# Altium project GeneratedSystem.PrjPcb
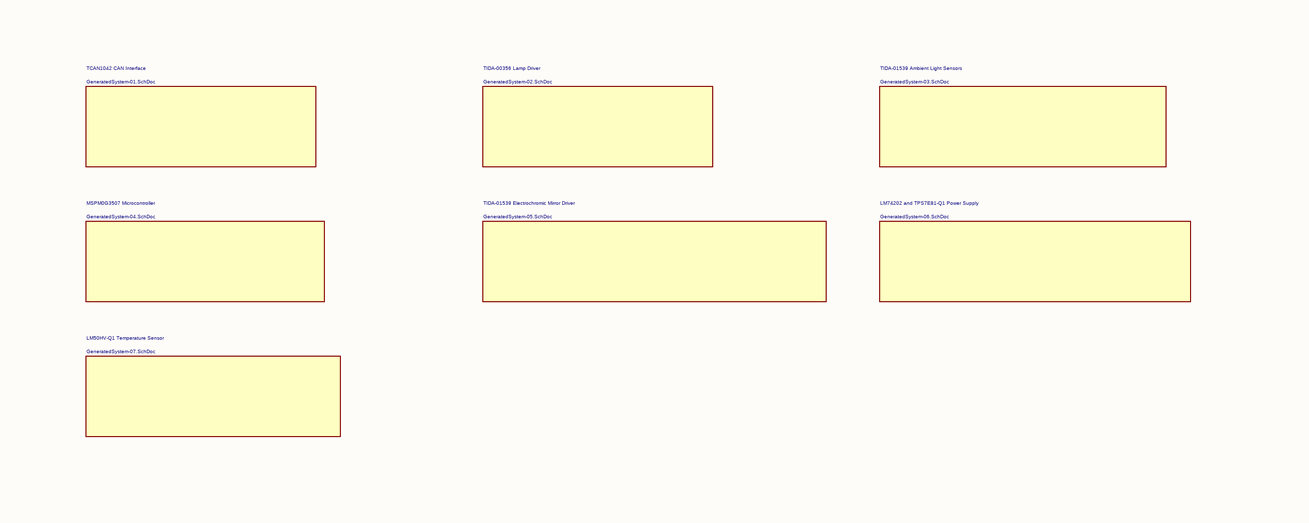
[diagram p0: GeneratedSystem.SchDoc]
8 sheets, 73 parts. Net scope: global (net labels, ports and power ports of the same name join across sheets).
Board file: GeneratedSystem.PcbDoc
Sheets:
  GeneratedSystem.SchDoc
    TCAN1042 CAN Interface = GeneratedSystem-01.SchDoc
    TIDA-00356 Lamp Driver = GeneratedSystem-02.SchDoc
    TIDA-01539 Ambient Light Sensors = GeneratedSystem-03.SchDoc
    MSPM0G3507 Microcontroller = GeneratedSystem-04.SchDoc
    TIDA-01539 Electrochromic Mirror Driver = GeneratedSystem-05.SchDoc
    LM74202 and TPS7E81-Q1 Power Supply = GeneratedSystem-06.SchDoc
    LM50HV-Q1 Temperature Sensor = GeneratedSystem-07.SchDoc

## Sheet GeneratedSystem.SchDoc
size 244 x 96 mm

### Sub-sheets
LM50HV-Q1 Temperature Sensor = GeneratedSystem-07.SchDoc: no entries
LM74202 and TPS7E81-Q1 Power Supply = GeneratedSystem-06.SchDoc: no entries
MSPM0G3507 Microcontroller = GeneratedSystem-04.SchDoc: no entries
TCAN1042 CAN Interface = GeneratedSystem-01.SchDoc: no entries
TIDA-00356 Lamp Driver = GeneratedSystem-02.SchDoc: no entries
TIDA-01539 Ambient Light Sensors = GeneratedSystem-03.SchDoc: no entries
TIDA-01539 Electrochromic Mirror Driver = GeneratedSystem-05.SchDoc: no entries

## Sheet GeneratedSystem-01.SchDoc
size 141 x 76 mm
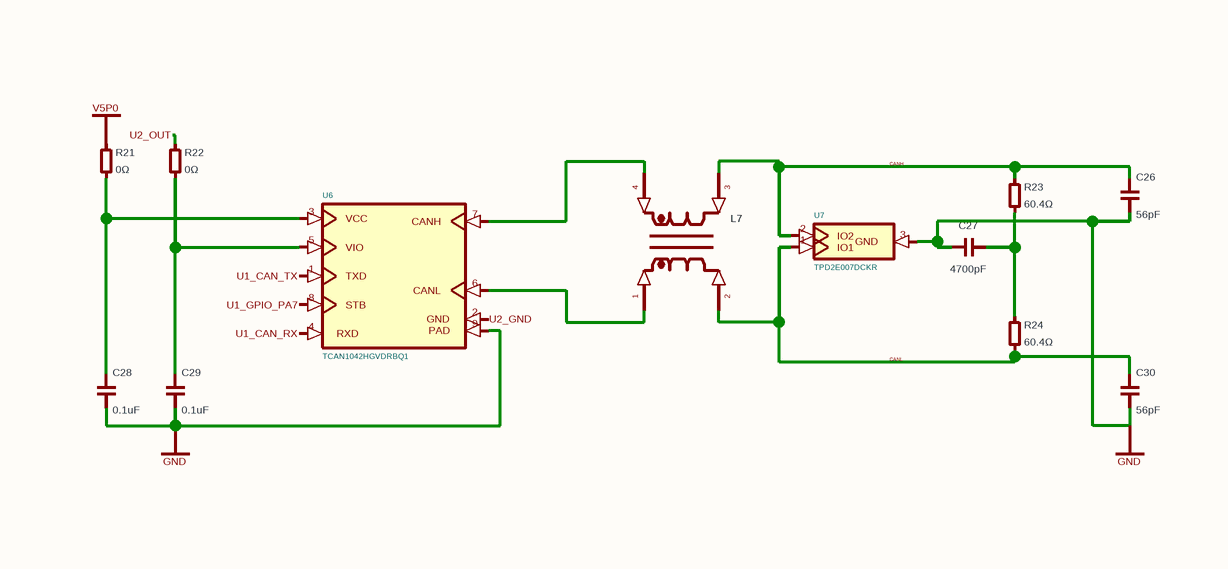
[diagram p1: GeneratedSystem-01.SchDoc]

### Parts
C26  56pF
C27  4700pF
C28  0.1uF
C29  0.1uF
C30  56pF
L7  (no value)
R21  0Ω
R22  0Ω
R23  60.4Ω
R24  60.4Ω
U6  (no value)
U7  (no value)

### Nets
GND: C26.2(cathode) C27.1(pos) C28.2(cathode) C29.2(cathode) C30.2(cathode) U6.9(PAD) U7.3(GND)
V5P0: R21.1(anode)
U1_CAN_RX: U6.4(RXD)
U1_CAN_TX: U6.1(TXD)
U1_GPIO_PA7: U6.8(STB)
U2_GND: U6.2(GND)
U2_OUT: R22.1(anode)
NetC26_1: C26.1(anode) L7.3(pin3) R23.1(anode) U7.2(IO2)
NetC27_2: C27.2(neg) R23.2(cathode) R24.1(anode)
NetC28_1: C28.1(anode) R21.2(cathode) U6.3(VCC)
NetC29_1: C29.1(anode) R22.2(cathode) U6.5(VIO)
NetC30_1: C30.1(anode) L7.2(pin2) R24.2(cathode) U7.1(IO1)
NetL7_1: L7.1(pin1) U6.6(CANL)
NetL7_4: L7.4(pin4) U6.7(CANH)

### Notes on the sheet
- CANH
- CANL
- (in symbol U6) TCAN1042HGVDRBQ1
- (in symbol U7) TPD2E007DCKR

### Library data of the parts
C26 C28-C30 = capacitor_down
C27 = capacitor_right
L7 = L7
R21-R24 = boxresistor_down
U6 = U6
U7 = U7

## Sheet GeneratedSystem-02.SchDoc
size 168 x 103 mm
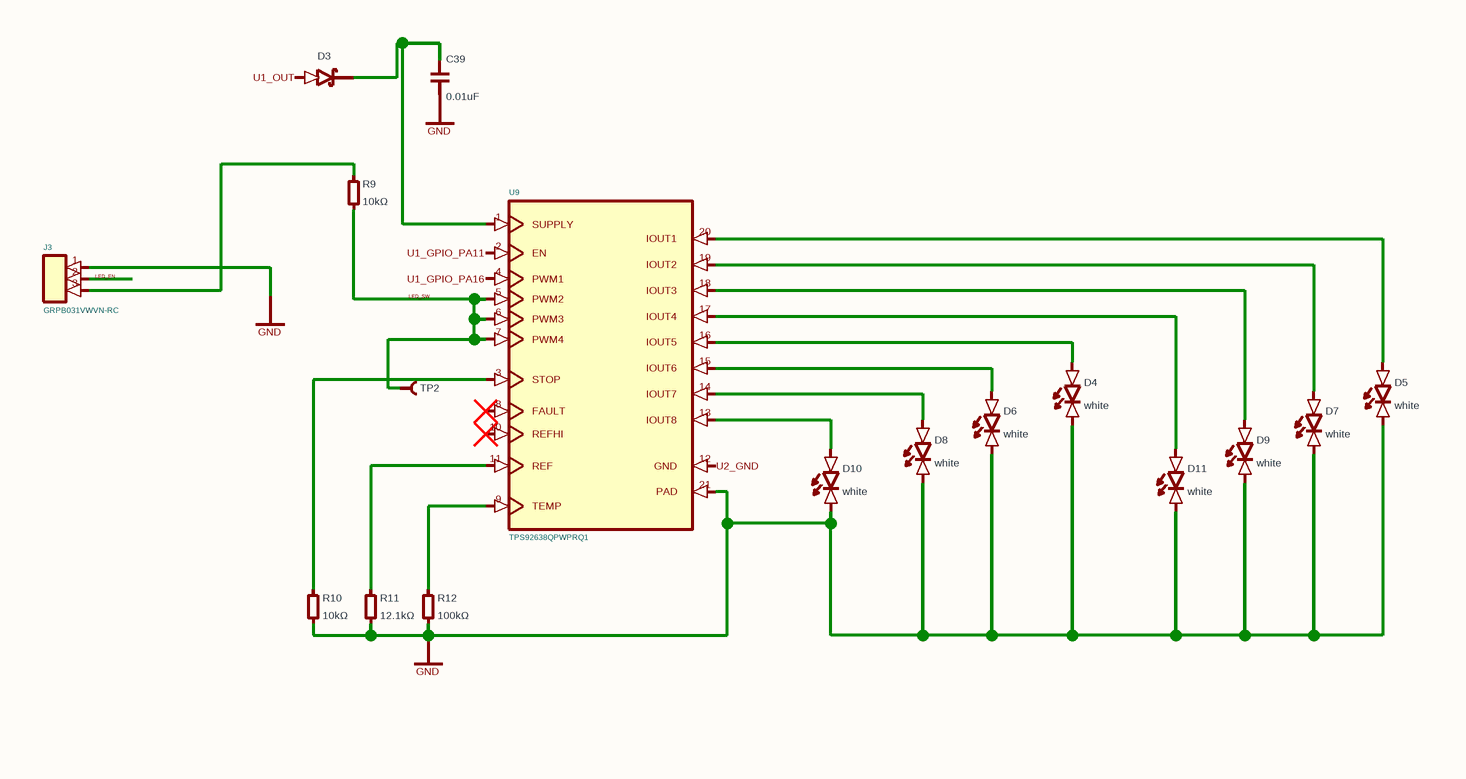
[diagram p2: GeneratedSystem-02.SchDoc]

### Parts
C39  0.01uF
D3  (no value)
D4  white
D5  white
D6  white
D7  white
D8  white
D9  white
D10  white
D11  white
J3  (no value)
R9  10kΩ
R10  10kΩ
R11  12.1kΩ
R12  100kΩ
TP2  (no value)
U9  (no value)

### Nets
GND: C39.2(cathode) D4.2(cathode) D5.2(cathode) D6.2(cathode) D7.2(cathode) D8.2(cathode) D9.2(cathode) D10.2(cathode) D11.2(cathode) J3.1(pin1) R10.2(cathode) R11.2(cathode) R12.2(cathode) U9.21(PAD)
U1_GPIO_PA11: U9.2(EN)
U1_GPIO_PA16: U9.4(PWM1)
U1_OUT: D3.1(pos)
U2_GND: U9.12(GND)
NetC39_1: C39.1(anode) D3.2(neg) U9.1(SUPPLY)
NetD4_1: D4.1(anode) U9.16(IOUT5)
NetD5_1: D5.1(anode) U9.20(IOUT1)
NetD6_1: D6.1(anode) U9.15(IOUT6)
NetD7_1: D7.1(anode) U9.19(IOUT2)
NetD8_1: D8.1(anode) U9.14(IOUT7)
NetD9_1: D9.1(anode) U9.18(IOUT3)
NetD10_1: D10.1(anode) U9.13(IOUT8)
NetD11_1: D11.1(anode) U9.17(IOUT4)
NetJ3_3: J3.3(pin3) R9.1(anode)
NetR9_2: R9.2(cathode) TP2.1(pin1) U9.5(PWM2) U9.6(PWM3) U9.7(PWM4)
NetR10_1: R10.1(anode) U9.3(STOP)
NetR11_1: R11.1(anode) U9.11(REF)
NetR12_1: R12.1(anode) U9.9(TEMP)

Not connected (* = marked no-connect by the designer): J3 2(pin2); U9 8(FAULT)* 10(REFHI)*

### Notes on the sheet
- (near J3) LED_EN
- LED_SW
- (in symbol J3) GRPB031VWVN-RC
- (in symbol U9) TPS92638QPWPRQ1

### Library data of the parts
C39 = capacitor_down
D3 = schottky_diode_right
D4-D11 = led_down
J3 = J3
R9-R12 = boxresistor_down
TP2 = testpoint_right
U9 = U9

## Sheet GeneratedSystem-03.SchDoc
size 101 x 101 mm
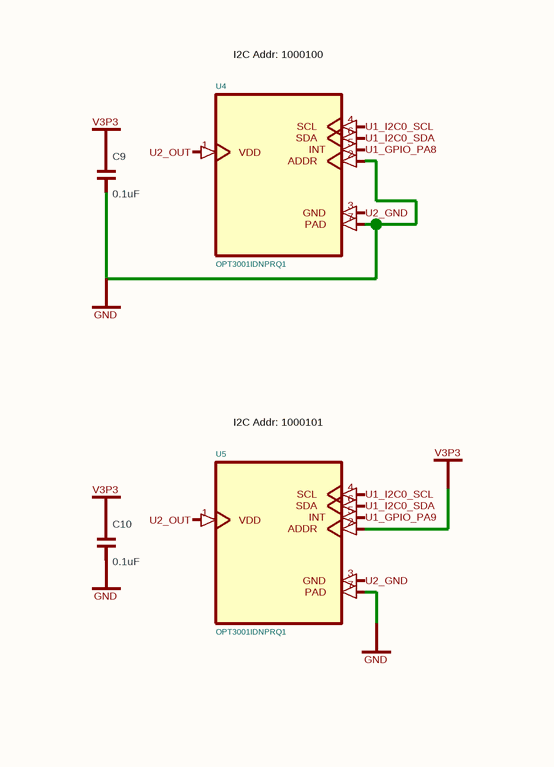
[diagram p3: GeneratedSystem-03.SchDoc]

### Parts
C9  0.1uF
C10  0.1uF
U4  (no value)
U5  (no value)

### Nets
GND: C9.2(cathode) C10.2(cathode) U4.2(ADDR) U4.7(PAD) U5.7(PAD)
V3P3: C9.1(anode) C10.1(anode) U5.2(ADDR)
U1_GPIO_PA8: U4.5(INT)
U1_GPIO_PA9: U5.5(INT)
U1_I2C0_SCL: U4.4(SCL) U5.4(SCL)
U1_I2C0_SDA: U4.6(SDA) U5.6(SDA)
U2_GND: U4.3(GND) U5.3(GND)
U2_OUT: U4.1(VDD) U5.1(VDD)

### Notes on the sheet
- (near U4) I2C Addr: 1000100
- (near U5) I2C Addr: 1000101
- (in symbol U4) OPT3001IDNPRQ1
- (in symbol U5) OPT3001IDNPRQ1

### Library data of the parts
C9 C10 = capacitor_down
U4 = U4
U5 = U5

## Sheet GeneratedSystem-04.SchDoc
size 117 x 96 mm
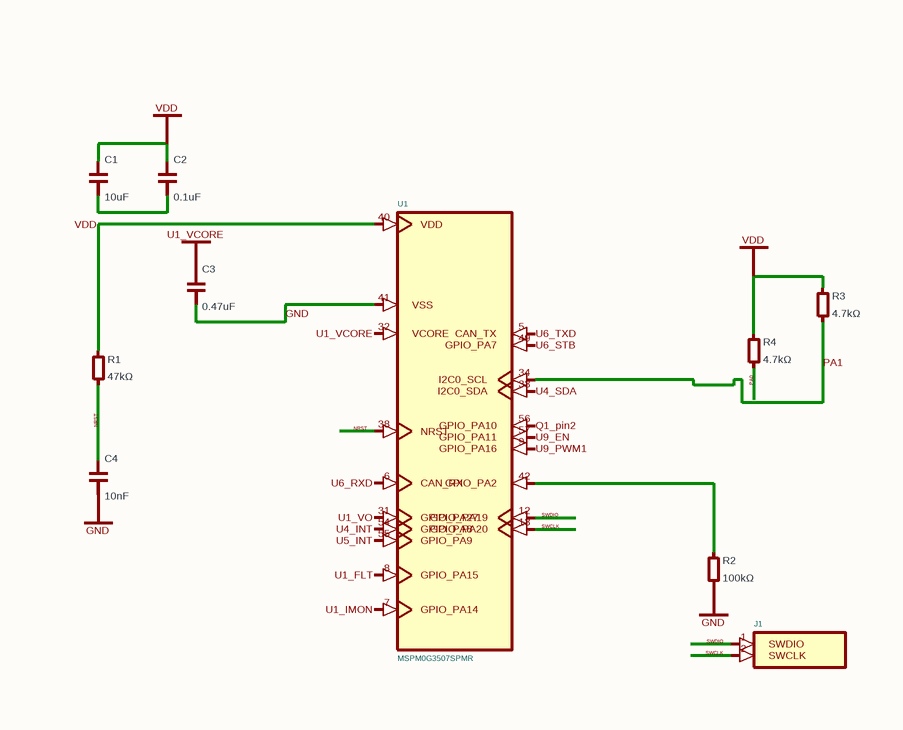
[diagram p4: GeneratedSystem-04.SchDoc]

### Parts
(Parts that share a designator on the sheet are numbered #1, #2 ... from top to bottom, then left to right.)
C1#1  10uF
C2#1  0.1uF
C3#1  0.47uF
C4#1  10nF
J1  (no value)
R1#1  47kΩ
R2#1  100kΩ
R3#1  4.7kΩ
R4  4.7kΩ
U1#1  (no value)

### Nets
GND: C3#1.2(cathode) C4#1.2(cathode) R2#1.2(cathode) U1#1.41(VSS)
U1_VCORE: C3#1.1(anode) U1#1.32(VCORE)
VDD: C1#1.1(anode) C2#1.1(anode) R1#1.2(cathode) R3#1.2(cathode) R4.2(cathode) U1#1.40(VDD)
PA1: R3#1.1(anode) U1#1.34(I2C0_SCL)
Q1_pin2: U1#1.56(GPIO_PA10)
U1_FLT: U1#1.8(GPIO_PA15)
U1_IMON: U1#1.7(GPIO_PA14)
U1_VO: U1#1.31(GPIO_PA27)
U4_INT: U1#1.54(GPIO_PA8)
U4_SDA: U1#1.33(I2C0_SDA)
U5_INT: U1#1.55(GPIO_PA9)
U6_RXD: U1#1.6(CAN_RX)
U6_STB: U1#1.49(GPIO_PA7)
U6_TXD: U1#1.5(CAN_TX)
U9_EN: U1#1.57(GPIO_PA11)
U9_PWM1: U1#1.9(GPIO_PA16)
NetC1#1_2: C1#1.2(cathode) C2#1.2(cathode)
NetC4#1_1: C4#1.1(anode) R1#1.1(anode)
NetR2#1_1: R2#1.1(anode) U1#1.42(GPIO_PA2)

Not connected (* = marked no-connect by the designer): J1 1(SWDIO) 2(SWCLK); R4 1(anode); U1#1 12(GPIO_PA19) 13(GPIO_PA20) 38(NRST)

### Notes on the sheet
- NRST
- (near U1#1) NRST
- (near R4) PA0
- (near U1#1) SWDIO
- (near U1#1) SWCLK
- (near J1) SWDIO
- (near J1) SWCLK
- (in symbol U1) MSPM0G3507SPMR

### Library data of the parts
C1#1 C2#1 C3#1 C4#1 = capacitor_down
J1 = J1
R1#1 R3#1 R4 = boxresistor_up
R2#1 = boxresistor_down
U1#1 = U1

## Sheet GeneratedSystem-05.SchDoc
size 150 x 80 mm
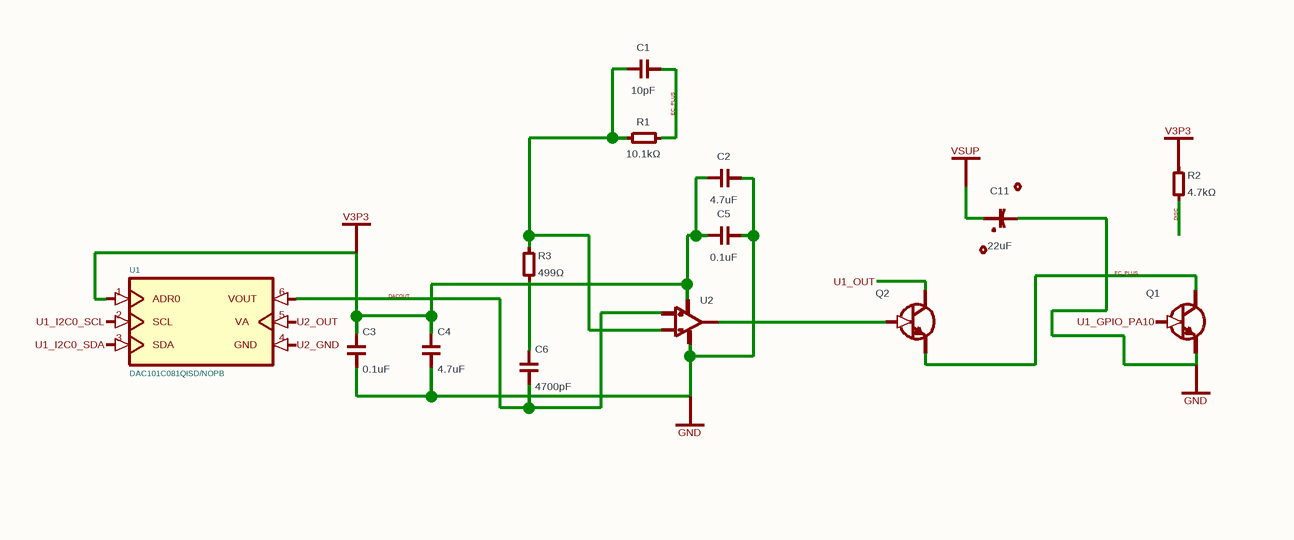
[diagram p5: GeneratedSystem-05.SchDoc]

### Parts
(Parts that share a designator on the sheet are numbered #1, #2 ... from top to bottom, then left to right.)
C1#2  10pF
C2#2  4.7uF
C3#2  0.1uF
C4#2  4.7uF
C5  0.1uF
C6  4700pF
C11  22uF
Q1  (no value)
Q2  (no value)
R1#2  10.1kΩ
R2#2  4.7kΩ
R3#2  499Ω
U1#2  (no value)
U2#1  (no value)

### Nets
GND: C2#2.2(neg) C3#2.2(cathode) C4#2.2(cathode) C5.2(neg) C11.2(neg) Q1.3(emitter) U2#1.3(V-)
V3P3: C2#2.1(pos) C3#2.1(anode) C4#2.1(anode) C5.1(pos) R2#2.1(anode) U1#2.1(ADR0) U2#1.5(V+)
VSUP: C11.1(pos)
U1_GPIO_PA10: Q1.2(base)
U1_I2C0_SCL: U1#2.2(SCL)
U1_I2C0_SDA: U1#2.3(SDA)
U1_OUT: Q2.1(collector)
U2_GND: U1#2.4(GND)
U2_OUT: U1#2.5(VA)
NetC1#2_1: C1#2.1(pos) R1#2.2(cathode)
NetC1#2_2: C1#2.2(neg) R1#2.1(anode) R3#2.1(anode) U2#1.2(inp2)
NetC6_1: C6.1(anode) R3#2.2(cathode)
NetC6_2: C6.2(cathode) U1#2.6(VOUT) U2#1.1(inp1)
NetQ1_1: Q1.1(collector) Q2.3(emitter)
NetQ2_2: Q2.2(base) U2#1.4(out)

Not connected (* = marked no-connect by the designer): R2#2 2(cathode)

### Notes on the sheet
- EC_PLUS
- DACOUT
- (near R2#2) DISC
- (in symbol U1) DAC101C081QISD/NOPB

### Library data of the parts
C1#2 = capacitor_left
C2#2 C5 = capacitor_right
C3#2 C4#2 C6 = capacitor_down
C11 = capacitor_polarized_right
Q1 Q2 = npn_bipolar_transistor_down
R1#2 = boxresistor_right
R2#2 R3#2 = boxresistor_down
U1#2 = U1
U2#1 = opamp_with_power_right

## Sheet GeneratedSystem-06.SchDoc
size 186 x 83 mm
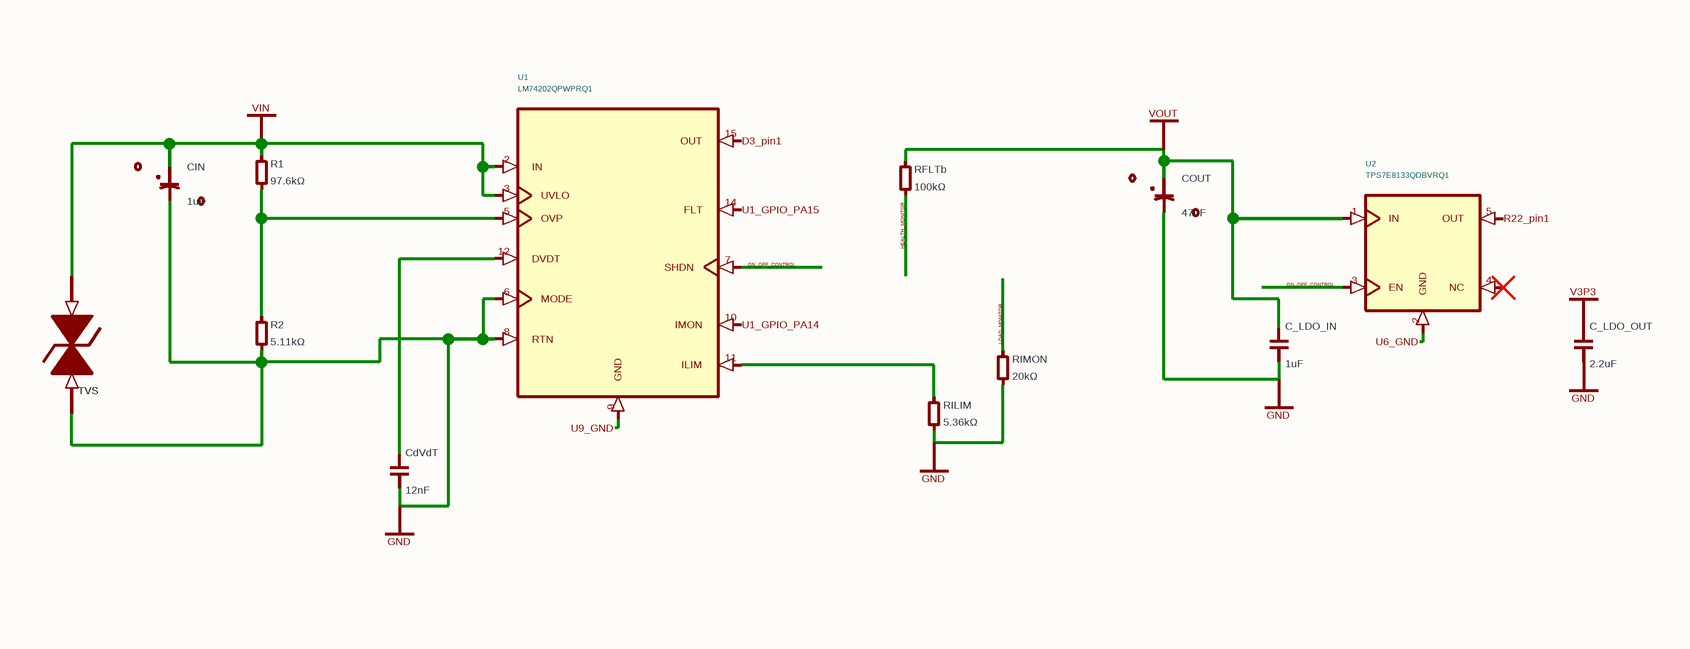
[diagram p6: GeneratedSystem-06.SchDoc]

### Parts
(Parts that share a designator on the sheet are numbered #1, #2 ... from top to bottom, then left to right.)
C_LDO_IN  1uF
C_LDO_OUT  2.2uF
CdVdT  12nF
CIN  1uF
COUT  47uF
R1#3  97.6kΩ
R2#3  5.11kΩ
RFLTb  100kΩ
RILIM  5.36kΩ
RIMON  20kΩ
TVS  (no value)
U1#3  (no value)
U2#2  (no value)

### Nets
GND: C_LDO_IN.2(cathode) C_LDO_OUT.2(cathode) CdVdT.2(cathode) CIN.2(neg) COUT.2(neg) R2#3.2(cathode) RILIM.2(cathode) RIMON.2(cathode) TVS.1(pin1) U1#3.6(MODE) U1#3.8(RTN)
V3P3: C_LDO_OUT.1(anode)
VIN: CIN.1(pos) R1#3.1(anode) TVS.2(pin2) U1#3.2(IN) U1#3.3(UVLO)
VOUT: C_LDO_IN.1(anode) COUT.1(pos) RFLTb.1(anode) U2#2.1(IN)
D3_pin1: U1#3.15(OUT)
R22_pin1: U2#2.5(OUT)
U1_GPIO_PA14: U1#3.10(IMON)
U1_GPIO_PA15: U1#3.14(FLT)
U6_GND: U2#2.2(GND)
U9_GND: U1#3.9(GND)
NetCdVdT_1: CdVdT.1(anode) U1#3.12(DVDT)
NetR1#3_2: R1#3.2(cathode) R2#3.1(anode) U1#3.5(OVP)
NetRILIM_1: RILIM.1(anode) U1#3.11(ILIM)

Not connected (* = marked no-connect by the designer): RFLTb 2(cathode); RIMON 1(anode); U1#3 7(SHDN); U2#2 3(EN) 4(NC)*

### Notes on the sheet
- (near U1#3) ON_OFF_CONTROL
- (near RFLTb) HEALTH_MONITOR
- (near U2#2) ON_OFF_CONTROL
- (near RIMON) LOAD_MONITOR
- (in symbol U1) LM74202QPWPRQ1
- (in symbol U2) TPS7E8133QDBVRQ1

### Library data of the parts
C_LDO_IN C_LDO_OUT CdVdT = capacitor_down
CIN COUT = capacitor_polarized_down
R1#3 R2#3 RFLTb RILIM RIMON = boxresistor_down
TVS = TVS
U1#3 = U1
U2#2 = U2

## Sheet GeneratedSystem-07.SchDoc
size 101 x 76 mm
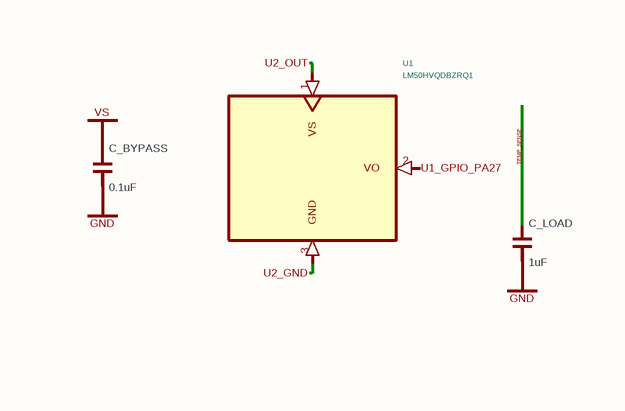
[diagram p7: GeneratedSystem-07.SchDoc]

### Parts
(Parts that share a designator on the sheet are numbered #1, #2 ... from top to bottom, then left to right.)
C_BYPASS  0.1uF
C_LOAD  1uF
U1#4  (no value)

### Nets
GND: C_BYPASS.2(cathode) C_LOAD.2(cathode)
VS: C_BYPASS.1(anode)
U1_GPIO_PA27: U1#4.2(VO)
U2_GND: U1#4.3(GND)
U2_OUT: U1#4.1(VS)

Not connected (* = marked no-connect by the designer): C_LOAD 1(anode)

### Notes on the sheet
- TEMP_SENSE
- (in symbol U1) LM50HVQDBZRQ1

### Library data of the parts
C_BYPASS C_LOAD = capacitor_down
U1#4 = U1

## Nets that join several sheets
GND: GeneratedSystem-01 (7 pins), GeneratedSystem-02 (14 pins), GeneratedSystem-03 (5 pins), GeneratedSystem-04 (C3#1.2 C4#1.2 R2#1.2 U1#1.41), GeneratedSystem-05 (7 pins), GeneratedSystem-06 (11 pins), GeneratedSystem-07 (C_BYPASS.2 C_LOAD.2)
V3P3: GeneratedSystem-03 (C9.1 C10.1 U5.2), GeneratedSystem-05 (7 pins), GeneratedSystem-06 (C_LDO_OUT.1)
U1_I2C0_SCL: GeneratedSystem-03 (U4.4 U5.4), GeneratedSystem-05 (U1#2.2)
U1_I2C0_SDA: GeneratedSystem-03 (U4.6 U5.6), GeneratedSystem-05 (U1#2.3)
U1_OUT: GeneratedSystem-02 (D3.1), GeneratedSystem-05 (Q2.1)
U2_GND: GeneratedSystem-01 (U6.2), GeneratedSystem-02 (U9.12), GeneratedSystem-03 (U4.3 U5.3), GeneratedSystem-05 (U1#2.4), GeneratedSystem-07 (U1#4.3)
U2_OUT: GeneratedSystem-01 (R22.1), GeneratedSystem-03 (U4.1 U5.1), GeneratedSystem-05 (U1#2.5), GeneratedSystem-07 (U1#4.1)